# EAGLE design PCA9548ABreakout (EAGLE 6.6.0)
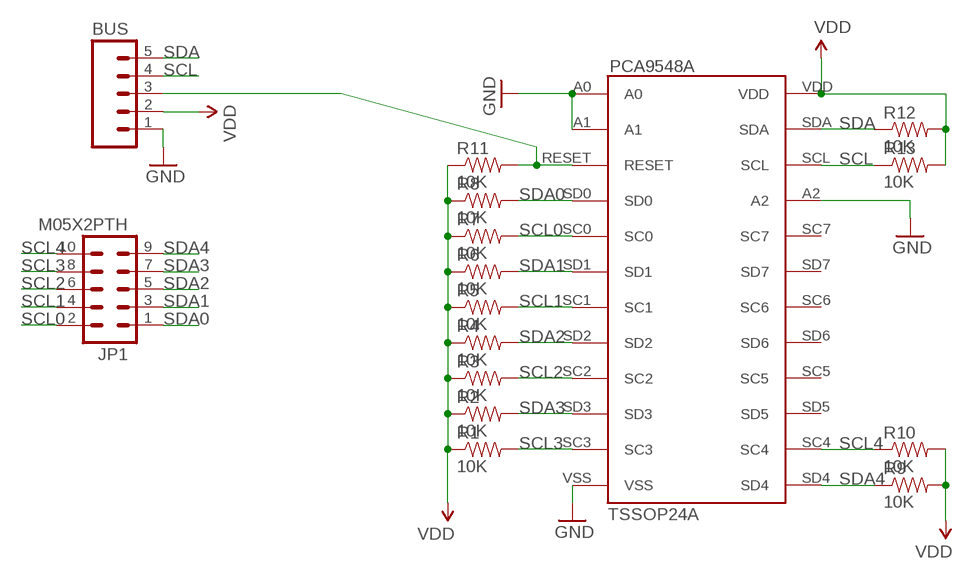
[diagram p0: schematic, sheet 1]

## Parts
BUS  M05PTH  [1X05]
JP1  M05X2PTH  [AVR_ICSP]
PCA9548A  TSSOP24A  [TSSOP24]
R1  10K  10KOHM1/10W1%(0603)0603  [0603-RES]
R2  10K  10KOHM1/10W1%(0603)0603  [0603-RES]
R3  10K  10KOHM1/10W1%(0603)0603  [0603-RES]
R4  10K  10KOHM1/10W1%(0603)0603  [0603-RES]
R5  10K  10KOHM1/10W1%(0603)0603  [0603-RES]
R6  10K  10KOHM1/10W1%(0603)0603  [0603-RES]
R7  10K  10KOHM1/10W1%(0603)0603  [0603-RES]
R8  10K  10KOHM1/10W1%(0603)0603  [0603-RES]
R9  10K  10KOHM1/10W1%(0603)0603  [0603-RES]
R10  10K  10KOHM1/10W1%(0603)0603  [0603-RES]
R11  10K  10KOHM1/10W1%(0603)0603  [0603-RES]
R12  10K  10KOHM1/10W1%(0603)0603  [0603-RES]
R13  10K  10KOHM1/10W1%(0603)0603  [0603-RES]

## Nets
GND: BUS.1 PCA9548A.A0 PCA9548A.A1 PCA9548A.A2 PCA9548A.VSS
N$1: BUS.3 PCA9548A.RESET R11.2
SCL: BUS.4 PCA9548A.SCL R13.1
SCL0: JP1.2 PCA9548A.SC0 R7.2
SCL1: JP1.4 PCA9548A.SC1 R5.2
SCL2: JP1.6 PCA9548A.SC2 R3.2
SCL3: JP1.8 PCA9548A.SC3 R1.2
SCL4: JP1.10 PCA9548A.SC4 R10.1
SDA: BUS.5 PCA9548A.SDA R12.1
SDA0: JP1.1 PCA9548A.SD0 R8.2
SDA1: JP1.3 PCA9548A.SD1 R6.2
SDA2: JP1.5 PCA9548A.SD2 R4.2
SDA3: JP1.7 PCA9548A.SD3 R2.2
SDA4: JP1.9 PCA9548A.SD4 R9.1
VDD: BUS.2 PCA9548A.VDD R1.1 R2.1 R3.1 R4.1 R5.1 R6.1 R7.1 R8.1 R9.2 R10.2 R11.1 R12.2 R13.2
Unconnected: PCA9548A.SC5 PCA9548A.SC6 PCA9548A.SC7 PCA9548A.SD5 PCA9548A.SD6 PCA9548A.SD7

## Library data of the parts
BUS = SparkFun-Connectors:M05: Header 5 Standard 5-pin 0.1" header. Use with straight break away headers (SKU : PRT-00116), right angle break away headers (PRT-00553), swiss pins (PRT-00743), machine pins (PRT-00117), and female headers (PRT-00115). Molex polarized connector foot print use with SKU : PRT-08230 with associated crimp pins and housings.
JP1 = SparkFun-Connectors:M05X2: Header 5x2 Standard 10-pin dual row 0.1" header. Commonly used with AVR-ISP. Use with Spark Fun Electronics SKU: PRT-00778
PCA9548A = PCA9548A:TSSOP24
R1-R13 = SparkFun-Resistors:10KOHM1/10W1%(0603): RES-00824; PROD_ID: RES-00824

## Board
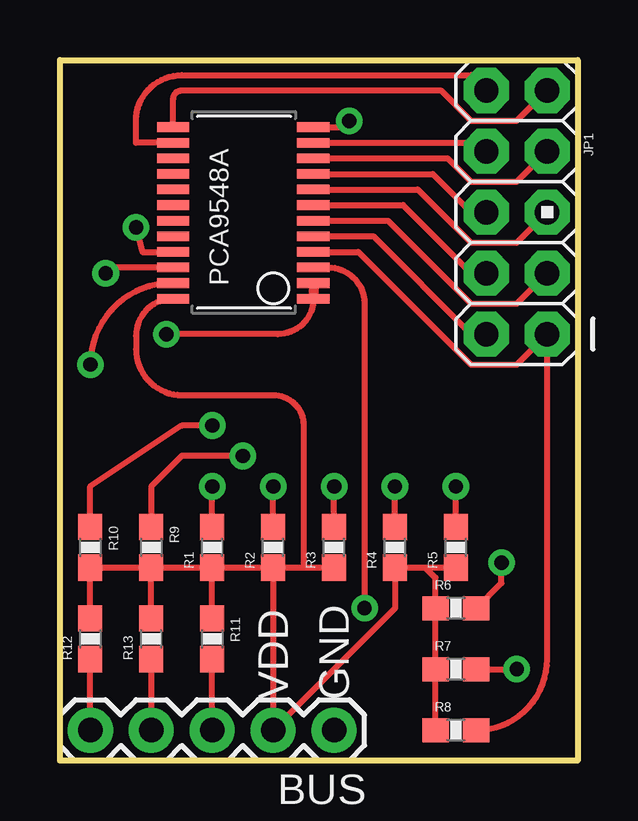
[diagram p1: board, top side]
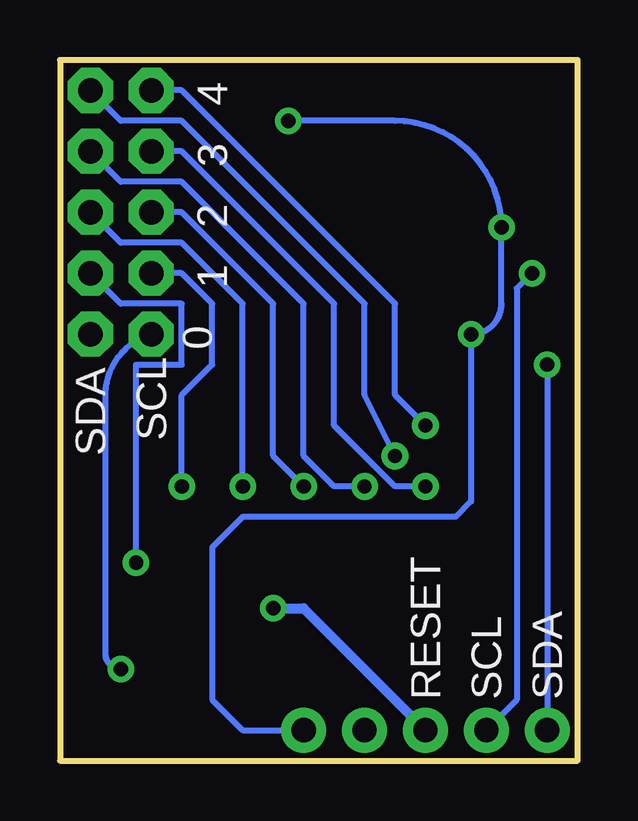
[diagram p2: board, bottom side, seen from below]

Size 21.59 x 29.21 mm. Coordinates in mm from the lower left corner, seen from the top.
Outline: 0,0 0,29.21 21.59,29.21 21.59,0 0,0
Copper layers (1*16): Top 0.035mm / dielectric 1.5mm / Bottom 0.035mm
Design rules "SparkFun": minimum track width 8mil, minimum drill 20mil, track to track 8mil, track to pad 8mil, pad to pad 8mil, via to via 8mil, smd to smd 8mil, copper to edge 8mil, drill to drill 8mil, minimum pad ring 12mil, minimum via ring 10mil, stop-mask expansion 4mil, vias tented up to drill 20mil, thermal gap 10mil

### Footprints (pad centres in the part's own frame; a part is rotated, then mirrored left to right if it is on the bottom)
1X05 = drill 1.016 pad 1.88: 1 0,0; 2 2.54,0; 3 5.08,0; 4 7.62,0; 5 10.16,0
AVR_ICSP = drill 1.016 pad 1.88 octagon: 1 -1.27,5.08; 2 1.27,5.08; 3 -1.27,2.54; 4 1.27,2.54; 5 -1.27,0; 6 1.27,0; 7 -1.27,-2.54; 8 1.27,-2.54; 9 -1.27,-5.08; 10 1.27,-5.08
TSSOP24 = smd 1.35 x 0.4: A0 -2.95,3.6; A1 -2.95,2.95; A2 2.9,1.65; RESET -2.95,2.3; SC0 -2.95,1; SC1 -2.95,-0.3; SC2 -2.95,-1.6; SC3 -2.95,-2.9; SC4 2.9,-2.9; SC5 2.9,-1.6; SC6 2.9,-0.3; SC7 2.9,1; SCL 2.9,2.3; SD0 -2.95,1.65; SD1 -2.95,0.35; SD2 -2.95,-0.95; SD3 -2.95,-2.25; SD4 2.9,-3.55; SD5 2.9,-2.25; SD6 2.9,-0.95; SD7 2.9,0.35; SDA 2.9,2.95; VDD 2.9,3.6; VSS -2.95,-3.55
0603-RES = smd 1.1 x 1: 1 -0.85,0; 2 0.85,0

### Placement (x,y rotation side)
BUS  11.43,1.27 180 top
JP1  19.05,22.86 180 top
PCA9548A  7.62,22.86 180 top
R1  6.35,8.89 90 top
R2  8.89,8.89 90 top
R3  11.43,8.89 90 top
R4  13.97,8.89 90 top
R5  16.51,8.89 90 top
R6  16.51,6.35 0 top
R7  16.51,3.81 0 top
R8  16.51,1.27 0 top
R9  3.81,8.89 270 top
R10  1.27,8.89 270 top
R11  6.35,5.08 270 top
R12  1.27,5.08 90 top
R13  3.81,5.08 90 top

### Tracks (layer width: path | path; a pad name or v marks a point on that pad's centre or on a via)
GND  (via drill 0.6)
  Top 0.254: v3.17,22.23 3.43,21.21 PCA9548A.A2 | PCA9548A.A0 arc-90 9.09,17.78 v4.45,17.78 | PCA9548A.VSS 11.8,26.41 v12.06,26.67
  Top 0.406: PCA9548A.A1 PCA9548A.A0
  Bottom 0.254: v12.06,26.67 7.62,26.67 arc90 v3.17,22.23 3.17,19.05 arc90 v4.45,17.78 4.45,10.79 5.08,10.16 13.97,10.16 15.24,8.89 15.24,2.54 13.97,1.27 BUS.1
N$1  (via drill 0.6)
  Top 0.254: PCA9548A.RESET 11.19,20.56 arc-90 12.7,19.05 v12.7,6.35 | BUS.3 R11.2
  Bottom 0.406: v12.7,6.35 11.43,6.35 BUS.3
SCL  (via drill 0.6)
  Top 0.254: PCA9548A.SCL 2.15,20.56 v1.91,20.32 | R13.1 BUS.4
  Bottom 0.254: v1.91,20.32 2.54,19.68 2.54,2.54 BUS.4
SCL0  (via drill 0.6)
  Top 0.254: R7.2 v19.05,3.81 | PCA9548A.SC0 13.06,21.86 17.14,17.78 JP1.2
  Bottom 0.254: v19.05,3.81 arc90 19.68,4.45 19.68,15.24 arc74 JP1.2
SCL1  (via drill 0.6)
  Top 0.254: PCA9548A.SC1 14.3,23.16 17.14,20.32 JP1.4 | R5.2 v16.51,11.43
  Bottom 0.254: v16.51,11.43 16.51,15.24 15.24,16.51 15.24,19.05 16.51,20.32 JP1.4
SCL2  (via drill 0.6)
  Top 0.254: PCA9548A.SC2 15.54,24.46 17.14,22.86 JP1.6 | R3.2 v11.43,11.43
  Bottom 0.254: v11.43,11.43 12.7,12.7 12.7,19.05 16.51,22.86 JP1.6
SCL3  (via drill 0.6)
  Top 0.254: PCA9548A.SC3 17.42,25.76 JP1.8 | R1.2 v6.35,11.43
  Bottom 0.254: v6.35,11.43 7.62,11.43 10.16,13.97 10.16,19.05 16.51,25.4 JP1.8
SCL4  (via drill 0.6)
  Top 0.254: PCA9548A.SC4 3.17,25.76 3.17,26.67 arc-90 5.08,28.57 17.14,28.57 arc-90 JP1.10 | R10.1 1.27,11.43 5.08,13.97 v6.35,13.97
  Bottom 0.254: v6.35,13.97 7.62,15.24 7.62,19.05 16.51,27.94 JP1.10
SDA  (via drill 0.6)
  Top 0.254: PCA9548A.SDA 4.67,19.91 arc90 v1.27,16.51 | BUS.5 R12.1
  Bottom 0.254: v1.27,16.51 BUS.5
SDA0
  Top 0.254: PCA9548A.SD0 12.45,21.21 17.14,16.51 19.05,16.51 JP1.1 20.32,4.23 arc-90 R8.2
SDA1  (via drill 0.6)
  Top 0.254: PCA9548A.SD1 13.69,22.51 17.14,19.05 19.05,19.05 JP1.3 | R6.2 18.41,7.41 v18.41,8.26
  Bottom 0.254: v18.41,8.26 18.41,16.51 16.51,16.51 16.51,19.05 19.05,19.05 JP1.3
SDA2  (via drill 0.6)
  Top 0.254: PCA9548A.SD2 14.93,23.81 17.14,21.59 19.05,21.59 JP1.5 | R4.2 v13.97,11.43
  Bottom 0.254: v13.97,11.43 13.97,19.05 16.51,21.59 19.05,21.59 JP1.5
SDA3  (via drill 0.6)
  Top 0.254: PCA9548A.SD3 16.16,25.11 17.14,24.13 19.05,24.13 JP1.7 | R2.2 v8.89,11.43
  Bottom 0.254: v8.89,11.43 10.16,11.43 11.43,12.7 11.43,19.05 16.51,24.13 19.05,24.13 JP1.7
SDA4  (via drill 0.6)
  Top 0.254: PCA9548A.SD4 4.72,27.58 arc-90 5.08,27.94 15.88,27.94 17.14,26.67 19.05,26.67 JP1.9 | R9.1 3.81,11.43 5.08,12.7 v7.62,12.7
  Bottom 0.254: JP1.9 19.05,26.67 16.51,26.67 8.89,19.05 8.89,15.24 v7.62,12.7
VDD
  Top 0.254: R8.1 R7.1 R6.1 15.66,7.62 15.24,8.04 | R5.1 15.24,8.04 | 15.24,8.04 R4.1 13.97,6.35 BUS.2 R2.1 | R3.1 10.16,8.04 | 10.16,8.04 R2.1 | R2.1 8.89,5.93 | R11.1 R1.1 | R13.2 R9.2 | R12.2 R10.2 R9.2 | PCA9548A.VDD arc90 3.17,17.71 3.17,17.14 arc90 5.08,15.24 8.89,15.24 arc-90 10.16,13.97 10.16,8.04 | R2.1 R1.1 | R1.1 R9.2

### Text on the board
tPlace: VDD | GND
bPlace: 4 | 3 | 2 | 1 | 0 | SCL | SDA | SDA | SCL | RESET